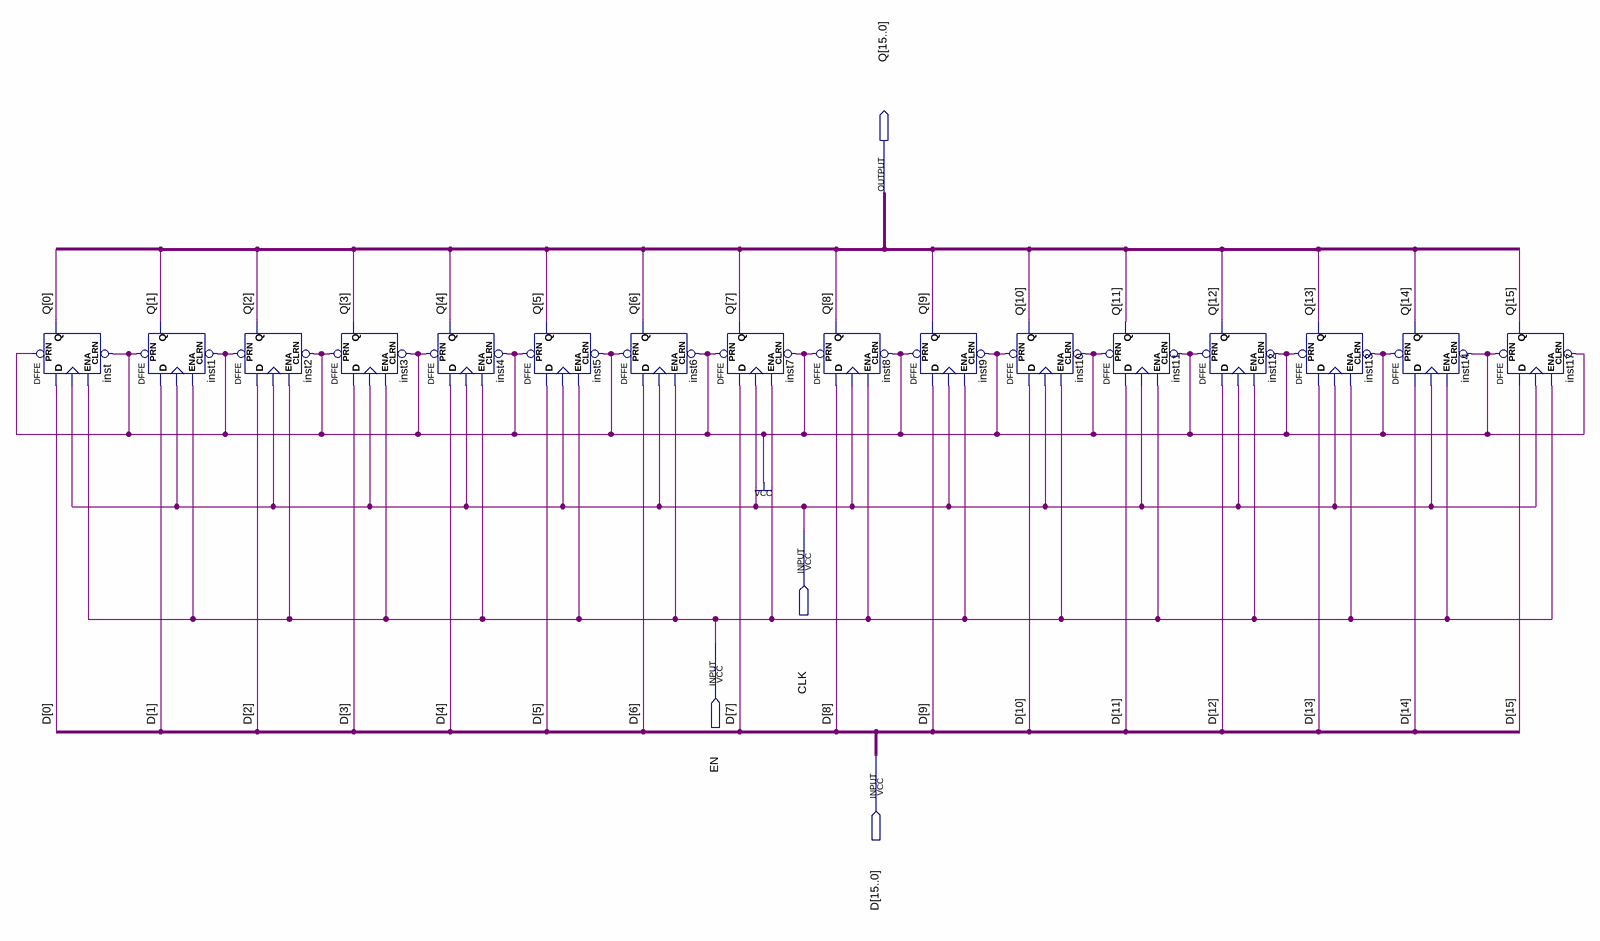
[diagram p0: schematic sheet]
// Quartus schematic 16bitregister.bdf as structural Verilog: 16 symbols, 4 pins
module \16bitregister  (
  input  CLK,
  input  EN,
  input  [15:0] D,
  output [15:0] Q
);

  DFFE inst (.PRN(1'b1), .CLRN(1'b1), .D(D[0]), .CLK(CLK), .ENA(EN), .Q(Q[0]));
  DFFE inst1 (.PRN(1'b1), .CLRN(1'b1), .D(D[1]), .CLK(CLK), .ENA(EN), .Q(Q[1]));
  DFFE inst2 (.PRN(1'b1), .CLRN(1'b1), .D(D[2]), .CLK(CLK), .ENA(EN), .Q(Q[2]));
  DFFE inst3 (.PRN(1'b1), .CLRN(1'b1), .D(D[3]), .CLK(CLK), .ENA(EN), .Q(Q[3]));
  DFFE inst4 (.PRN(1'b1), .CLRN(1'b1), .D(D[4]), .CLK(CLK), .ENA(EN), .Q(Q[4]));
  DFFE inst5 (.PRN(1'b1), .CLRN(1'b1), .D(D[5]), .CLK(CLK), .ENA(EN), .Q(Q[5]));
  DFFE inst6 (.PRN(1'b1), .CLRN(1'b1), .D(D[6]), .CLK(CLK), .ENA(EN), .Q(Q[6]));
  DFFE inst7 (.PRN(1'b1), .CLRN(1'b1), .D(D[7]), .CLK(CLK), .ENA(EN), .Q(Q[7]));
  DFFE inst8 (.PRN(1'b1), .CLRN(1'b1), .D(D[8]), .CLK(CLK), .ENA(EN), .Q(Q[8]));
  DFFE inst9 (.PRN(1'b1), .CLRN(1'b1), .D(D[9]), .CLK(CLK), .ENA(EN), .Q(Q[9]));
  DFFE inst10 (.PRN(1'b1), .CLRN(1'b1), .D(D[10]), .CLK(CLK), .ENA(EN), .Q(Q[10]));
  DFFE inst11 (.PRN(1'b1), .CLRN(1'b1), .D(D[11]), .CLK(CLK), .ENA(EN), .Q(Q[11]));
  DFFE inst12 (.PRN(1'b1), .CLRN(1'b1), .D(D[12]), .CLK(CLK), .ENA(EN), .Q(Q[12]));
  DFFE inst13 (.PRN(1'b1), .CLRN(1'b1), .D(D[13]), .CLK(CLK), .ENA(EN), .Q(Q[13]));
  DFFE inst14 (.PRN(1'b1), .CLRN(1'b1), .D(D[14]), .CLK(CLK), .ENA(EN), .Q(Q[14]));
  DFFE inst17 (.PRN(1'b1), .CLRN(1'b1), .D(D[15]), .CLK(CLK), .ENA(EN), .Q(Q[15]));
endmodule
